# Altium schematic sheet TIDA-01485_Hardware.SchDoc
size 431 x 279 mm; Date: Not shown in title block; ApprovedBy: Not shown in title block; CheckedBy: Not shown in title block; Author: Not shown in title block; CompanyName: Not shown in title block; DrawnBy: Manu; Engineer: Not shown in title block; Organization: Not shown in title block; Address1: Not shown in title block; Address2: Not shown in title block; Address3: Not shown in title block; Address4: Not shown in title block; DocumentNumber: 1; Revision: Use project parameter SCH_Rev; SheetNumber: 5; SheetTotal: 5; PageSetup: Record=PageOptions|CenterHorizontal=True|CenterVertical=True|PrintScale=1.00|XCorrection=1.00|YCorrection=1.00|PrintKind=0|BorderSize=5000000|LeftOffset=0|BottomOffset=0|Orientation=2|PaperLength=1000|PaperWidth=1000|Scale=100|PaperSource=15|PrintQuality=600|MediaType=1|DitherType=10|PaperKind=Letter|PrintScaleMode=1; CurrentTime: Not shown in title block; CurrentDate: Not shown in title block; Time: Not shown in title block; DocumentFullPathAndName: Not shown in title block; DocumentName: Not shown in title block; ModifiedDate: Not shown in title block; ImagePath: Not shown in title block
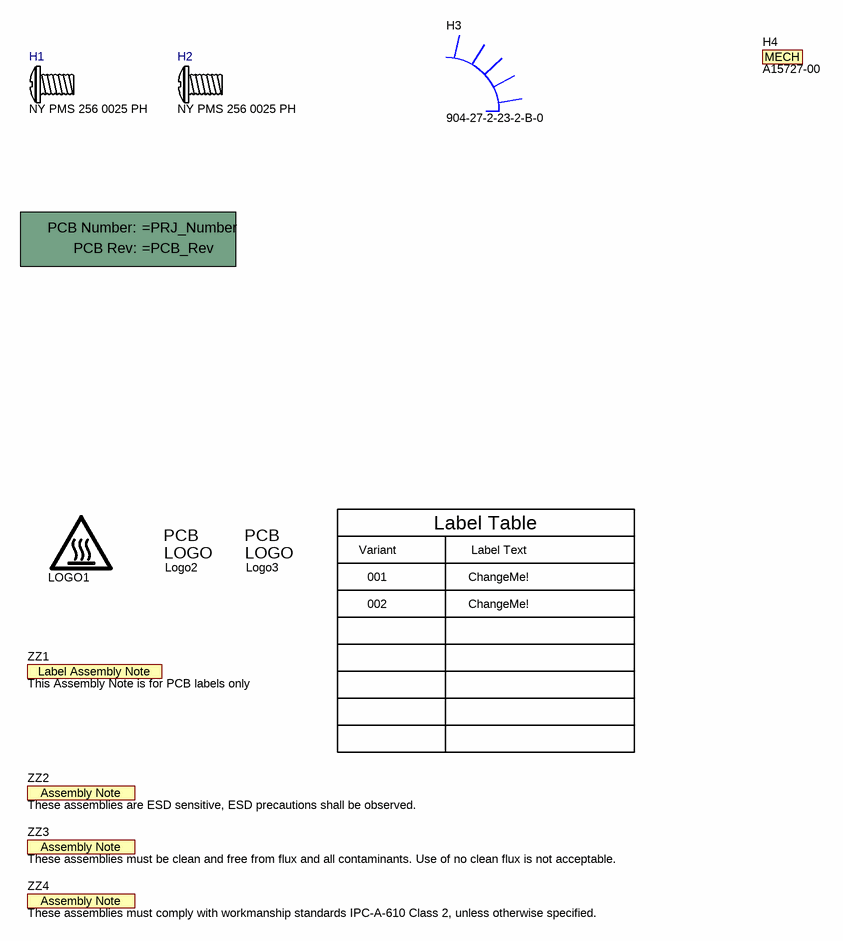
[diagram p0: TIDA-01485_Hardware.SchDoc]

## Parts
!PCB1  Printed Circuit Board  (value not drawn)  (mechanical)
H1  NY PMS 256 0025 PH  [NY PMS 256 0025 PH]
H2  NY PMS 256 0025 PH  [NY PMS 256 0025 PH]
H3  904-27-2-23-2-B-0  [CTS_BDN09-3CB_A01]
H4  A15727-00  (mechanical)
LOGO1  CAUTION HOT SURFACE  [IEC_HotSurface_small]  (value not drawn)  (no BOM)
Logo2  ESD Susceptible  [ESD_Overlay_small]  (value not drawn)  (no BOM)
Logo3  Pb-Free Symbol  [Pb-Free_Overlay_small]  (value not drawn)  (no BOM)
ZZ1  This Assembly Note is for PCB labels only  [AssemblyNoteLabel]  (no BOM)
ZZ2  These assemblies are ESD sensitive, ESD precautions shall be observed.  [AssemblyNote]  (no BOM)
ZZ3  These assemblies must be clean and free from flux and all contaminants. Use of no clean flux is not acceptable.  [AssemblyNote]  (no BOM)
ZZ4  These assemblies must comply with workmanship standards IPC-A-610 Class 2, unless otherwise specified.  [AssemblyNote]  (no BOM)

## Notes on the sheet
- Variant
- 001
- Label Table
- Label Text
- ChangeMe!
- 002
- Drawn By:
- SVN Rev:
- Number:
- TID #:
- Orderable:
- Rev:
- Sheet Title:
- File:
- Project Title:
- Designed for:
- Assembly Variant:
- Mod. Date:
- Sheet:
- Size:
- of
- B
- http://www.ti.com
- Texas Instruments and/or its licensors do not warrant the accuracy or completeness of this specification or any information contained therein. Texas Instruments and/or its licensors do not warrant that this design will meet the specifications, will be suitable for your application or fit for any particular purpose, or will operate in an implementation. Texas Instruments and/or its licensors do not warrant that the design is production worthy. You should completely validate and test your design implementation to confirm the system functionality for your application.
- Engineer:
- Contact:
- © Texas Instruments
- (in symbol AssemblyNote) Assembly Note
- (in symbol AssemblyNoteLabel) Label Assembly Note
- (in symbol ESD_Susceptible) PCB; LOGO
- (in symbol Pb-Free) PCB; LOGO
- (in symbol PCB) PCB Number:; PCB Rev:
- (in symbol TG6050-150-150-0.5-0) MECH

## Library data of the parts
!PCB1 = PCB: Manufacturer: Any; SymbolCreator: a0412235; SymbolVersion: 2012-05-30; CompType: PCB; PartNumber: =PRJ_Number; RoHS: O; MountType: N/A; Publisher: Texas Instruments; LatestRevisionDate: 2015-02-25
H1 H2 = NY PMS 256 0025 PH: MACHINE SCREW PAN PHILLIPS 2-56; Manufacturer: B&F Fastener Supply; SymbolCreator: a0412235; SymbolVersion: 2013-06-24; CompType: Screw; PartNumber: NY PMS 256 0025 PH; RoHS: Y; PackageReference: Machine Screw Pan Phillips 2-56; MountType: N/A; ComponentLink1Description: Datasheet Link; ComponentLink1URL: http://www.fasnetdirect.com/refguide/Nylpanms.pdf; Publisher: Texas Instruments; LatestRevisionDate: 2017-05-31; Supplier 1: Digi-Key; Supplier Part Number 1: H530-ND
H3 = BDN09-3CB/A01: HEATSINK 27X27X23MM PIN; Manufacturer: Wakefield-Vette; SymbolCreator: a0412235; SymbolVersion: 2013-07-05; CompType: Heatsink; PartNumber: 904-27-2-23-2-B-0; RoHS: Y; PackageReference: HEATSINK 27X27X23MM PIN; MountType: N/A; ComponentLink1Description: Datasheet Link; ComponentLink1URL: https://media.digikey.com/pdf/Data%20Sheets/Wakefield%20Thermal%20PDFs/904_Series_Pin.pdf; Publisher: Texas Instruments; LatestRevisionDate: 2017-06-11; Supplier 1: Digi-Key; Supplier Part Number 1: 345-1142-ND
H4 = TG6050-150-150-0.5-0: Thermal Conductive Pad; Manufacturer: Laird Technologies - Thermal Materials; SymbolCreator: codlsc; CompType: Hardware; SymbolVersion: 2010-02-24; PartNumber: A15727-00; RoHS: Y; PackageReference: TPCM 5810 27mmx27mm; MountType: N/A; ComponentLink1Description: Datasheet Link; ComponentLink1URL: Laird Technologies - Thermal Materials; Publisher: Texas Instruments; LatestRevisionDate: 2017-06-11; Supplier 1: Digi-Key; Supplier Part Number 1: 926-1556-ND
LOGO1 = IEC_HotSurface: IEC 61010-1 Hot Surface Warning; SymbolCreator: a0412235; SymbolVersion: 2011-08-22; Published: 2009-03-03; Publisher: Texas Instruments; LatestRevisionDate: 2016-03-21
Logo2 = ESD_Susceptible: ESD Susceptible Symbol; SymbolCreator: a0412235; SymbolVersion: 2011-08-22; Published: 2009-03-03; Publisher: Texas Instruments; LatestRevisionDate: 2016-03-21
Logo3 = Pb-Free: SymbolCreator: a0412235; SymbolVersion: 2011-08-22; Published: 2009-03-03; Publisher: Texas Instruments; LatestRevisionDate: 2016-03-21
ZZ1 = AssemblyNoteLabel: SymbolCreator: a0412235; SymbolVersion: 2012-06-14; CompType: AssemblyNote; ClassName: AssemblyNote; Publisher: Texas Instruments; LatestRevisionDate: 2012-07-31; LatestRevisionNote: Initial Version; Alternate Manufacturer: -; Alternate PartNumber: -
ZZ2-ZZ4 = AssemblyNote: SymbolCreator: codlsc; SymbolVersion: 2010-05-18; CompType: AssemblyNote; ClassName: AssemblyNote; Publisher: Texas Instruments; LatestRevisionDate: 2012-06-14; LatestRevisionNote: Initial Version; Alternate Manufacturer: -; Alternate PartNumber: -